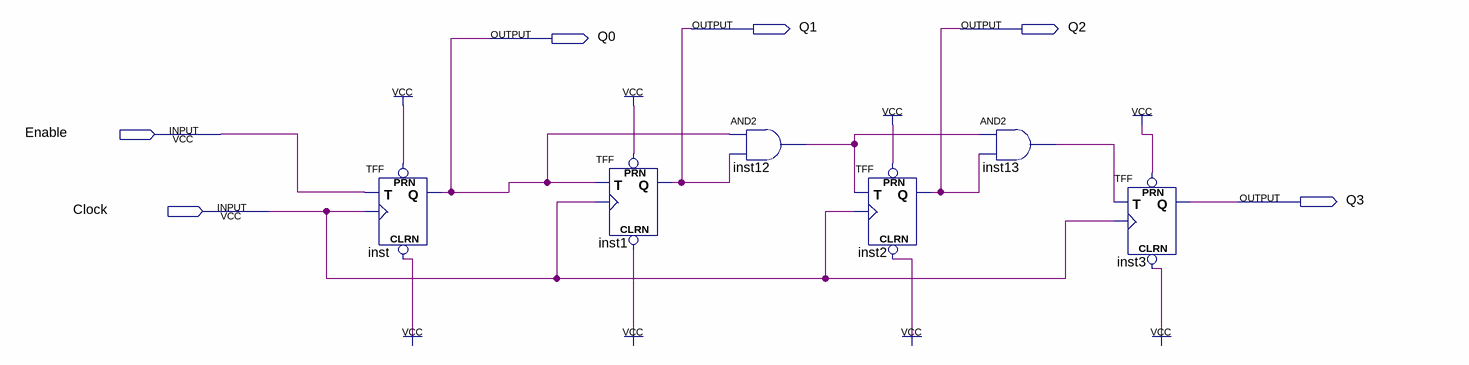
[diagram p0: schematic sheet]
// Quartus schematic labstep2b.bdf as structural Verilog: 6 symbols, 6 pins
module labstep2b (
  input  Enable,
  input  Clock,
  output Q1,
  output Q2,
  output Q0,
  output Q3
);

  wire inst12_out, inst13_out;

  TFF inst (.PRN(1'b1), .CLRN(1'b1), .T(Enable), .CLK(Clock), .Q(Q0));
  TFF inst1 (.PRN(1'b1), .CLRN(1'b1), .T(Q0), .CLK(Clock), .Q(Q1));
  and inst12 (inst12_out, Q0, Q1);
  TFF inst2 (.PRN(1'b1), .CLRN(1'b1), .T(inst12_out), .CLK(Clock), .Q(Q2));
  and inst13 (inst13_out, inst12_out, Q2);
  TFF inst3 (.PRN(1'b1), .CLRN(1'b1), .T(inst13_out), .CLK(Clock), .Q(Q3));
endmodule
